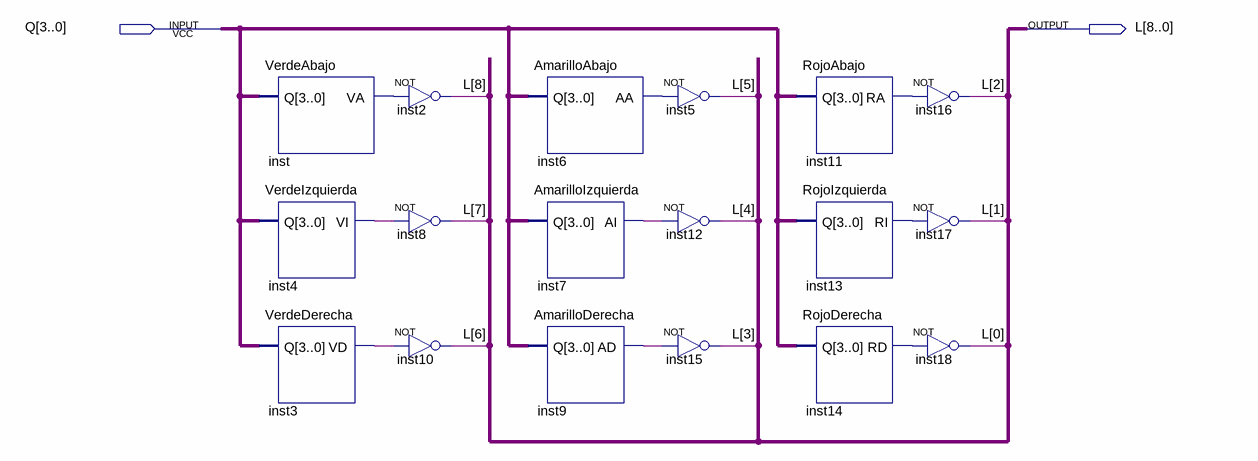
[diagram p0: schematic sheet]
// Quartus schematic GeneradorSalidas.bdf as structural Verilog: 18 symbols, 2 pins
module GeneradorSalidas (
  input  [3:0] Q,
  output [8:0] L
);

  wire inst3_vd, inst4_vi, inst6_aa, inst7_ai, inst9_ad, inst11_ra, inst13_ri, inst14_rd, inst_va;

  VerdeAbajo inst (.Q(Q), .VA(inst_va));
  VerdeIzquierda inst4 (.Q(Q), .VI(inst4_vi));
  VerdeDerecha inst3 (.Q(Q), .VD(inst3_vd));
  not inst2 (L[8], inst_va);
  not inst8 (L[7], inst4_vi);
  not inst10 (L[6], inst3_vd);
  AmarilloAbajo inst6 (.Q(Q), .AA(inst6_aa));
  AmarilloIzquierda inst7 (.Q(Q), .AI(inst7_ai));
  AmarilloDerecha inst9 (.Q(Q), .AD(inst9_ad));
  not inst5 (L[5], inst6_aa);
  not inst12 (L[4], inst7_ai);
  not inst15 (L[3], inst9_ad);
  RojoAbajo inst11 (.Q(Q), .RA(inst11_ra));
  RojoIzquierda inst13 (.Q(Q), .RI(inst13_ri));
  RojoDerecha inst14 (.Q(Q), .RD(inst14_rd));
  not inst16 (L[2], inst11_ra);
  not inst17 (L[1], inst13_ri);
  not inst18 (L[0], inst14_rd);
endmodule
